# Altium schematic sheet Sheet1.SchDoc
size A4
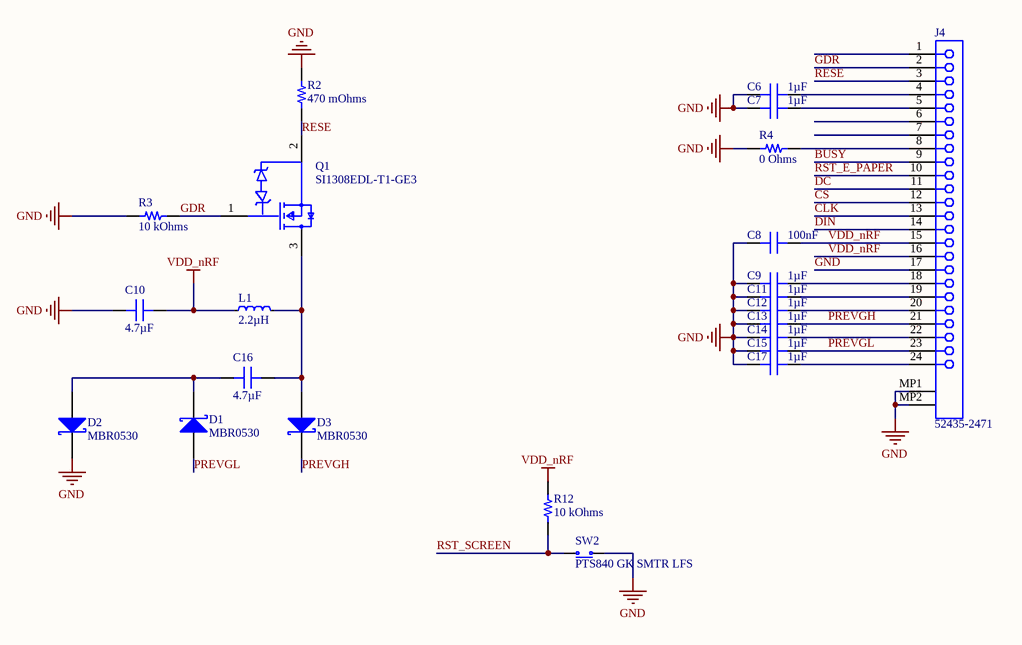
[diagram p0: Sheet1.SchDoc]

## Parts
C6  1µF  [CAP 0603_1608]
C7  1µF  [CAP 0603_1608]
C8  100nF  [CAP 0603_1608]
C9  1µF  [CAP 0603_1608]
C10  4.7µF  [CAP 0603_1608]
C11  1µF  [CAP 0603_1608]
C12  1µF  [CAP 0603_1608]
C13  1µF  [CAP 0603_1608]
C14  1µF  [CAP 0603_1608]
C15  1µF  [CAP 0603_1608]
C16  4.7µF  [CAP 0603_1608]
C17  1µF  [CAP 0603_1608]
D1  MBR0530  [FAIR-SOD123-2_V]
D2  MBR0530  [FAIR-SOD123-2_V]
D3  MBR0530  [FAIR-SOD123-2_V]
J4  52435-2471  [MOLX-52435-2471]
L1  2.2µH  [TY-NR3015]
Q1  SI1308EDL-T1-GE3  [FP-S-03946-MFG]
R2  470 mOhms  [RES 0603_1608]
R3  10 kOhms  [RES 0603_1608]
R4  0 Ohms  [RES 0603_1608]
R12  10 kOhms  [RES 0603_1608]
SW2  PTS840 GK SMTR LFS  [EVQP7A/J/B/K]

## Nets
GND: C6.1 C7.1 C8.1 C9.1 C10.1 C11.1 C12.1 C13.1 C14.1 C15.1 C17.1 D2.2(K) J4.17 J4.MP1 J4.MP2 R2.2 R3.1 R4.1 SW2.2(COM)
VDD_nRF: C8.2 C10.2 J4.15 J4.16 L1.1 R12.1
BUSY: J4.9
CLK: J4.13
CS: J4.12
DC: J4.11
DIN: J4.14
GDR: J4.2 Q1.1(G) R3.2
PREVGH: C13.2 D3.2(K) J4.21
PREVGL: C15.2 D1.1(A) J4.23
RESE: J4.3 Q1.2(S) R2.1
RST_E_PAPER: J4.10
RST_SCREEN: R12.2 SW2.1(N.O)
NetC6_2: C6.2 J4.4
NetC7_2: C7.2 J4.5
NetC9_2: C9.2 J4.18
NetC11_2: C11.2 J4.19
NetC12_2: C12.2 J4.20
NetC14_2: C14.2 J4.22
NetC16_1: C16.1 D1.2(K) D2.1(A)
NetC16_2: C16.2 D3.1(A) L1.2 Q1.3(D)
NetC17_2: C17.2 J4.24
NetJ4_8: J4.8 R4.2

Not connected (* = marked no-connect by the designer): J4 1 6 7

## Library data of the parts
C6 C7 C9 C11-C15 C17 = C0603C105K7PAC7867: CAP CER 1UF 4V X5R 0603; Manufacturer: KEMET; Tolerance: ±10%; Part Number: C0603C105K7PAC7867; Value: 1µF; Applications: General Purpose; Capacitance: 1µF; ComponentLink1Description: Datasheet; ComponentLink1URL: https://api.kemet.com/component-edge/download/datasheet/C0603C105K7PAC7867.pdf; ComponentLink2Description: DigiKey Link; ComponentLink2URL: http://digikey.com/product-detail/en/kemet/C0603C105K7PAC7867/399-14942-1-ND/7382491; Device Package: 0603 (1608 Metric); LastUpdated: 21/01/2020 00:01:35; Lifecycle Status: Active; Minimum Order: 1; Mounting Type: Surface Mount, MLCC; Operating Temperature: -55°C ~ 85°C; Package / Case: 0603 (1608 Metric); Packaging: TapeAndReel; PartId: 18572; Part Status: Active; Price: 0.03; Series: SMD Comm X5R; Size / Dimension: 0.063" L x 0.031" W (1.60mm x 0.80mm); Supplier 1: DigiKey; Supplier Part Number 1: 399-14942-1-ND; Temperature Coefficient: X5R; Thickness (Max): 0.035" (0.90mm); Voltage - Rated: 4V
C8 = C0603C105K7PAC7867: CAP CER 100nF 4V X5R 0603; Manufacturer: KEMET; Capacitance: 1µF; Tolerance: ±10%; Part Number: C0603C105K7PAC7867; Value: 100nF; Applications: General Purpose; ComponentLink1Description: Datasheet; ComponentLink1URL: https://api.kemet.com/component-edge/download/datasheet/C0603C105K7PAC7867.pdf; ComponentLink2Description: DigiKey Link; ComponentLink2URL: http://digikey.com/product-detail/en/kemet/C0603C105K7PAC7867/399-14942-1-ND/7382491; Device Package: 0603 (1608 Metric); LastUpdated: 21/01/2020 00:01:35; Lifecycle Status: Active; Minimum Order: 1; Mounting Type: Surface Mount, MLCC; Operating Temperature: -55°C ~ 85°C; Package / Case: 0603 (1608 Metric); Packaging: TapeAndReel; PartId: 18572; Part Status: Active; Price: 0.03; Series: SMD Comm X5R; Size / Dimension: 0.063" L x 0.031" W (1.60mm x 0.80mm); Supplier 1: DigiKey; Supplier Part Number 1: 399-14942-1-ND; Temperature Coefficient: X5R; Thickness (Max): 0.035" (0.90mm); Voltage - Rated: 4V
C10 C16 = LMK107BJ475KA-T: CAP CER 4.7UF 10V X5R 0603; Manufacturer: Taiyo Yuden; Tolerance: ±10%; Part Number: LMK107BJ475KA-T; Value: 4.7µF; Applications: General Purpose; Capacitance: 4.7µF; ComponentLink1Description: Datasheet; ComponentLink1URL: https://ds.yuden.co.jp/TYCOMPAS/ut/detail?pn=LMK107BJ475KA-T  &u=M; ComponentLink2Description: DigiKey Link; ComponentLink2URL: http://digikey.com/product-detail/en/taiyo-yuden/LMK107BJ475KA-T/587-1441-1-ND/1004072; Device Package: 0603 (1608 Metric); LastUpdated: 21/01/2020 00:02:09; Lifecycle Status: Active; Minimum Order: 1; Mounting Type: Surface Mount, MLCC; Operating Temperature: -55°C ~ 85°C; Package / Case: 0603 (1608 Metric); Packaging: TapeAndReel; PartId: 2244; Part Status: Active; Price: 0.03; Series: M; Size / Dimension: 0.063" L x 0.031" W (1.60mm x 0.80mm); Supplier 1: DigiKey; Supplier Part Number 1: 587-1441-1-ND; Temperature Coefficient: X5R; Thickness (Max): 0.035" (0.90mm); Voltage - Rated: 10V
D1-D3 = CMP-2000-05113-1: Diode Schottky 30V 0.5A 2-Pin SOD-123 T/R; Manufacturer: Fairchild; Speed: FastRecovery=200mA(Io); Voltage - Forward (Vf) (Max) @ If: 430mV@500mA; Online Catalog: SchottkyDiode; Current - Reverse Leakage @ Vr: 130µA@30V; Current - Average Rectified (Io): 500mA; Other Names: MBR0530CT; Reverse Recovery Time (trr): -; Category: DiscreteSemiconductorProducts; Package / Case: SOD-123; Capacitance @ Vr, F: -; Operating Temperature - Junction: -65degC~125degC; Standard Package: 1; Packaging: CutTape(CT); Family: Diodes,Rectifiers-Single; Diode Type: Schottky; Series: -; Datasheet Version: Rev. 1.1.0, 10/2014; Supplier Device Package: SOD-123; Mounting Type: SurfaceMount; Datasheet URL: https://www.fairchildsemi.com/datasheets/MB/MBR0530.pdf; Manufacturer URL: https://www.fairchildsemi.com/; Voltage - DC Reverse (Vr) (Max): 30V
J4 = CMP-1241-00275-1: 0.5 mm Pitch Easy-On(TM) Type FPC Connector, 2.0 mm Mated Height, Right Angle, ZIF, SMT, Top Contact, 24 Circuits, -40 to 85 degC, ELV and RoHS Compliant, Tape and Reel; Manufacturer: Molex; Pitch - Mating Interface: 0.50mm; PCB Locator: No; Current (Max per Contact): 0.5A; PCB Retention: Yes; Circuits (Loaded): 24; Material - Metal: Phosphor Bronze; Material - Plating Termination: Gold; Mated Height: 2.00mm; Entry Angle: 90degrees Angle; Durability (mating cycles max): 20; Voltage (Max): 50V AC (RMS)/DC; PartNumber: 52435-2471; ComponentLink1Description: Manufacturer URL; Polarized to PCB: Yes; Contact Position: Top; RoHS: TRUE; ComponentLink3Description: Package Specification; Mounting Technology: Surface Mount; ComponentLink2URL: http://www.molex.com/webdocs/datasheets/pdf/en-us/0524352471_FFC_FPC_CONNECTORS.pdf; PackageDescription: 24-Lead FPC Connector, Pitch 0.5 mm; Packing: Tape and Reel; ComponentLink1URL: http://www.molex.com/molex/index.jsp; PackageVersion: Rev. D, 07/2010; ComponentLink3URL: http://www.molex.com/pdm_docs/sd/524352471_sd.pdf; Stackable: No; PackageReference: 52435-2471; Number of Rows: 1; ComponentLink2Description: Datasheet; Orientation: Right Angle; Material - Plating Mating: Gold
L1 = IND_1212: Ferrite Inductor, Shielded, 1,5A, 72mOhm; Part Number: NR3015-2µ2-1.5A-72mOhm; Manufacturer: Taiyo Yuden; Manufacturer Part Number: NR3015T2R2M; 2nd source part number: 188-5853; Artikkelnr Noca: 33029487; Artikkelnr Simpro: N.A.; Datasheet: http://www.yuden.co.jp/ut/product/category/inductor/NR3015T2R2M.pdf; Footprint Doc: 1212; LatestRevisionDate: 2014-01-22; Pin Count: 2; Publisher: Nordic Semiconductor; Published: 2014-01-22; Value: 2.2µH; Note: *; Supplier: Digi-Key; Supplier part number: 587-1648-1-ND; 2nd source Supplier: Farnell; ComponentLink1Description: Datasheet; ComponentLink2Description: Supplier link
Q1 = CMP-02550-000099-1: MOSFET N-CH 30V 1.4A SC-70-3; Manufacturer: Vishay; Threshold Vgs Max: 1.5V; Turn On Delay Time: 2ns; Gate Charge At Vgs: 2.7nC @ 10V; Typ Forward Diode Voltage: 0.8V; Gate To Source Voltage: 12V; Max Junction Temp: +150°C; Pulse Drain Current: 6A; Threshold Vgs Min: 0.6V; Number Of Channels: 1; Transconductance: 5S; Continuous Drain Current: 1.5A; Rthja Max: 250°C/W; Turn Off Delay Time: 8ns; Power Dissipation: 0.4W; Input Capacitace At Vds: 105pF @ 15V; Max Forward Diode Voltage: 1.2V; Reverse Recovery Charge: 3nC; Depletion Mode: False; Drain To Source Resistance: 0.11Ω; Height: 1.1mm; Lead Free: Yes; Ipc Land Pattern Name: SOT65P210X100-3; Drain To Source Voltage: 30V; Mouser Description: MOSFET 30V 1.5A; Temperature Range Low: -55°C; ComponentLink2URL: http://www.vishay.com/docs/63399/si1308edl.pdf; Package: S-03946; RoHS: TRUE; Device Class L1: Discrete Semiconductors; Manufacturer Part Number: SI1308EDL-T1-GE3; Category: Trans; Number Of N Channels: 1; Temperature Range High: +150°C; Octopart: https://octopart.com/si1308edl-t1-ge3-vishay-45284459; Automotive: No; Digikey Description: MOSFET N-CH 30V 1.4A SC-70-3; ComponentLink2Description: Datasheet; Device Class L3: MOSFETs; Reverse Recovery Time: 8ns; Device Class L2: Transistors; Drain To Source Breakdown Voltage: 30V; Temperature: -55°C to +150°C
R2 = RCWE0603R470FKEA: RES 0.47 OHM 1% 1/5W 0603; Manufacturer: Vishay Dale; Power (Watts): 0.2W, 1/5W; Temperature Coefficient: ±100ppm/°C; Part Number: RCWE0603R470FKEA; Value: 470 mOhms; ComponentLink1Description: Datasheet; ComponentLink1URL: http://www.vishay.com/docs/20019/rcwe.pdf; ComponentLink2Description: DigiKey Link; ComponentLink2URL: http://digikey.com/product-detail/en/vishay-dale/RCWE0603R470FKEA/RCWE.47CCT-ND/2276694; Composition: Thick Film; Device Package: 0603 (1608 Metric); Features: Automotive AEC-Q200, Current Sense, Moisture Resistant; Height - Seated (Max): 0.024" (0.60mm); LastUpdated: 21/01/2020 00:22:42; Lifecycle Status: Active; Minimum Order: 1; Number of Terminations: 2; Operating Temperature: -55°C ~ 155°C; Package / Case: 0603 (1608 Metric); Packaging: TapeAndReel; PartId: 10575; Part Status: Active; Price: 0.17; Ratings: AEC-Q200; Resistance: 470 mOhms; Series: RCWE; Size / Dimension: 0.063" L x 0.033" W (1.60mm x 0.85mm); Supplier 1: DigiKey; Supplier Part Number 1: RCWE.47CCT-ND; Supplier Device Package: 0603; Tolerance: ±1%
R3 R12 = RNCS0603BKE10K0: RES 10K OHM 0.1% 1/16W 0603; Manufacturer: Stackpole Electronics Inc; Power (Watts): 0.063W, 1/16W; Temperature Coefficient: ±25ppm/°C; Part Number: RNCS0603BKE10K0; Value: 10 kOhms; ComponentLink1Description: Datasheet; ComponentLink1URL: https://www.seielect.com/catalog/sei-rncs_rnch.pdf; ComponentLink2Description: DigiKey Link; ComponentLink2URL: http://digikey.com/product-detail/en/stackpole-electronics-inc/RNCS0603BKE10K0/RNCS0603BKE10K0CT-ND/1800113; Composition: Thin Film; Device Package: 0603 (1608 Metric); Features: Anti-Corrosive, Automotive AEC-Q200, Moisture Resistant; Height - Seated (Max): 0.022" (0.55mm); LastUpdated: 21/01/2020 00:25:01; Lifecycle Status: Active; Minimum Order: 1; Number of Terminations: 2; Operating Temperature: -55°C ~ 155°C; Package / Case: 0603 (1608 Metric); Packaging: TapeAndReel; PartId: 4838; Part Status: Active; Price: 0.08; Ratings: AEC-Q200; Resistance: 10 kOhms; Series: RNCS; Size / Dimension: 0.061" L x 0.031" W (1.55mm x 0.80mm); Supplier 1: DigiKey; Supplier Part Number 1: RNCS0603BKE10K0CT-ND; Supplier Device Package: 0603; Tolerance: ±0.1%
R4 = CRCW06030000Z0EAHP: RES SMD 0 OHM JUMPER 1/4W 0603; Manufacturer: Vishay Dale; Power (Watts): 0.25W, 1/4W; Part Number: CRCW06030000Z0EAHP; Value: 0 Ohms; ComponentLink1Description: Datasheet; ComponentLink1URL: http://www.vishay.com/docs/20043/crcwhpe3.pdf; ComponentLink2Description: DigiKey Link; ComponentLink2URL: http://digikey.com/product-detail/en/vishay-dale/CRCW06030000Z0EAHP/541-0.0SBCT-ND/2222749; Composition: Thick Film; Device Package: 0603 (1608 Metric); Features: Automotive AEC-Q200, Pulse Withstanding; Height - Seated (Max): 0.022" (0.55mm); LastUpdated: 21/01/2020 00:24:44; Lifecycle Status: Active; Minimum Order: 1; Number of Terminations: 2; Operating Temperature: -55°C ~ 155°C; Package / Case: 0603 (1608 Metric); Packaging: TapeAndReel; PartId: 5474; Part Status: Active; Price: 0.02; Ratings: AEC-Q200; Resistance: 0 Ohms; Series: CRCW-HP; Size / Dimension: 0.063" L x 0.033" W (1.60mm x 0.85mm); Supplier 1: DigiKey; Supplier Part Number 1: 541-0.0SBCT-ND; Supplier Device Package: 0603; Tolerance: Jumper
SW2 = PTS840 GK SMTR LFS: Microminiature SMT Switch, Side Actuated; Manufacturer: C&K Components; 2nd source part number: 611-PTS840GKSMTR; Part number IPS: 00000001260; Note: Tactile Switch, SPST, SMD, 220gf; Artikkelnr Noca: 50019089; Artikkelnr Simpro: N.A.; Part Number: PTS840 GK SMTR LFS; Manufacturer Part Number: PTS840 GK SMTR LFS; LatestRevisionDate: 2017-11-09; Pin Count: 4; Publisher: Nordic Semiconductor; Published: 2014-08-12; Value: PTS840 GK SMTR LFS; Supplier: Digi-Key; Supplier part number: CKN10508CT-ND; 2nd source Supplier: Mouser; Footprint Doc: PTS840 Gx; ComponentLink1Description: Datasheet; ComponentLink1URL: *; ComponentLink2Description: Supplier link; ComponentLink2URL: *; HelpURL: http://www.ck-components.com/80185/pts840_11june13.pdf/